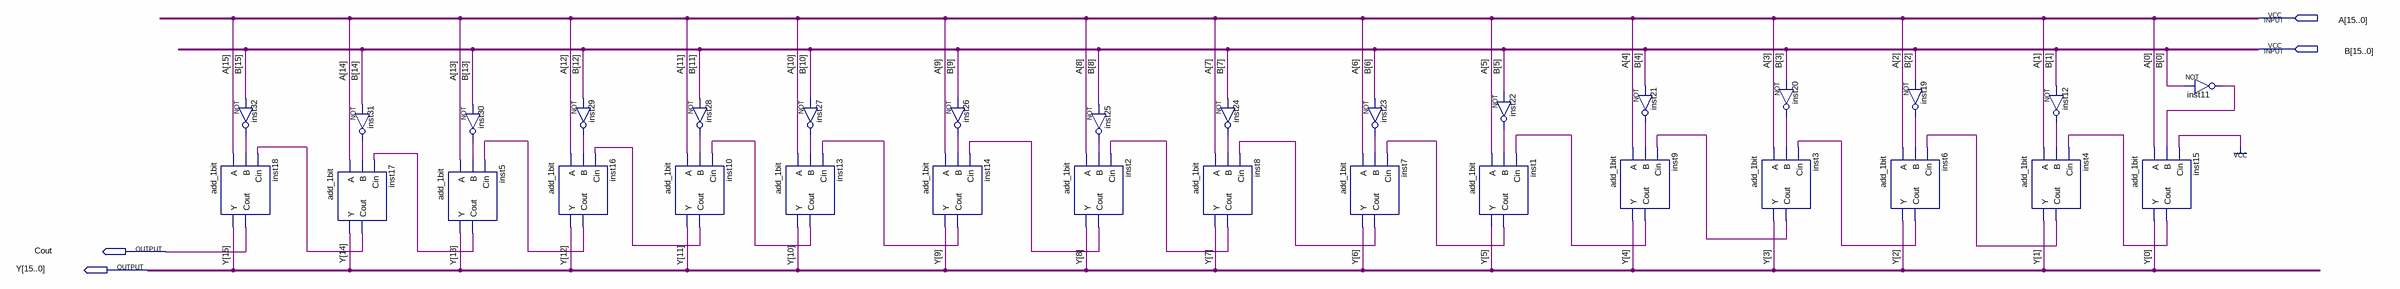
[diagram p0: schematic sheet]
// Quartus schematic sub_16bit.bdf as structural Verilog: 32 symbols, 4 pins
module sub_16bit (
  input  [15:0] A,
  input  [15:0] B,
  output Cout,
  output [15:0] Y
);

  wire inst1_cout, inst2_cout, inst3_cout, inst4_cout, inst5_cout, inst6_cout, inst7_cout, inst8_cout,
       inst9_cout, inst10_cout, inst11_out, inst12_out, inst13_cout, inst14_cout, inst15_cout, inst16_cout,
       inst17_cout, inst19_out, inst20_out, inst21_out, inst22_out, inst23_out, inst24_out, inst25_out,
       inst26_out, inst27_out, inst28_out, inst29_out, inst30_out, inst31_out, inst32_out;

  add_1bit inst18 (.A(A[15]), .B(inst32_out), .Cin(inst17_cout), .Y(Y[15]), .Cout(Cout));
  not inst32 (inst32_out, B[15]);
  not inst31 (inst31_out, B[14]);
  add_1bit inst17 (.A(A[14]), .B(inst31_out), .Cin(inst5_cout), .Y(Y[14]), .Cout(inst17_cout));
  add_1bit inst5 (.A(A[13]), .B(inst30_out), .Cin(inst16_cout), .Y(Y[13]), .Cout(inst5_cout));
  not inst30 (inst30_out, B[13]);
  add_1bit inst16 (.A(A[12]), .B(inst29_out), .Cin(inst10_cout), .Y(Y[12]), .Cout(inst16_cout));
  not inst29 (inst29_out, B[12]);
  not inst28 (inst28_out, B[11]);
  add_1bit inst10 (.A(A[11]), .B(inst28_out), .Cin(inst13_cout), .Y(Y[11]), .Cout(inst10_cout));
  not inst27 (inst27_out, B[10]);
  add_1bit inst13 (.A(A[10]), .B(inst27_out), .Cin(inst14_cout), .Y(Y[10]), .Cout(inst13_cout));
  not inst26 (inst26_out, B[9]);
  add_1bit inst14 (.A(A[9]), .B(inst26_out), .Cin(inst2_cout), .Y(Y[9]), .Cout(inst14_cout));
  not inst25 (inst25_out, B[8]);
  add_1bit inst2 (.A(A[8]), .B(inst25_out), .Cin(inst8_cout), .Y(Y[8]), .Cout(inst2_cout));
  add_1bit inst8 (.A(A[7]), .B(inst24_out), .Cin(inst7_cout), .Y(Y[7]), .Cout(inst8_cout));
  not inst24 (inst24_out, B[7]);
  add_1bit inst7 (.A(A[6]), .B(inst23_out), .Cin(inst1_cout), .Y(Y[6]), .Cout(inst7_cout));
  not inst23 (inst23_out, B[6]);
  add_1bit inst1 (.A(A[5]), .B(inst22_out), .Cin(inst9_cout), .Y(Y[5]), .Cout(inst1_cout));
  not inst22 (inst22_out, B[5]);
  not inst21 (inst21_out, B[4]);
  add_1bit inst9 (.A(A[4]), .B(inst21_out), .Cin(inst3_cout), .Y(Y[4]), .Cout(inst9_cout));
  not inst20 (inst20_out, B[3]);
  add_1bit inst3 (.A(A[3]), .B(inst20_out), .Cin(inst6_cout), .Y(Y[3]), .Cout(inst3_cout));
  add_1bit inst6 (.A(A[2]), .B(inst19_out), .Cin(inst4_cout), .Y(Y[2]), .Cout(inst6_cout));
  not inst19 (inst19_out, B[2]);
  add_1bit inst4 (.A(A[1]), .B(inst12_out), .Cin(inst15_cout), .Y(Y[1]), .Cout(inst4_cout));
  not inst12 (inst12_out, B[1]);
  add_1bit inst15 (.A(A[0]), .B(inst11_out), .Cin(1'b1), .Y(Y[0]), .Cout(inst15_cout));
  not inst11 (inst11_out, B[0]);
endmodule
